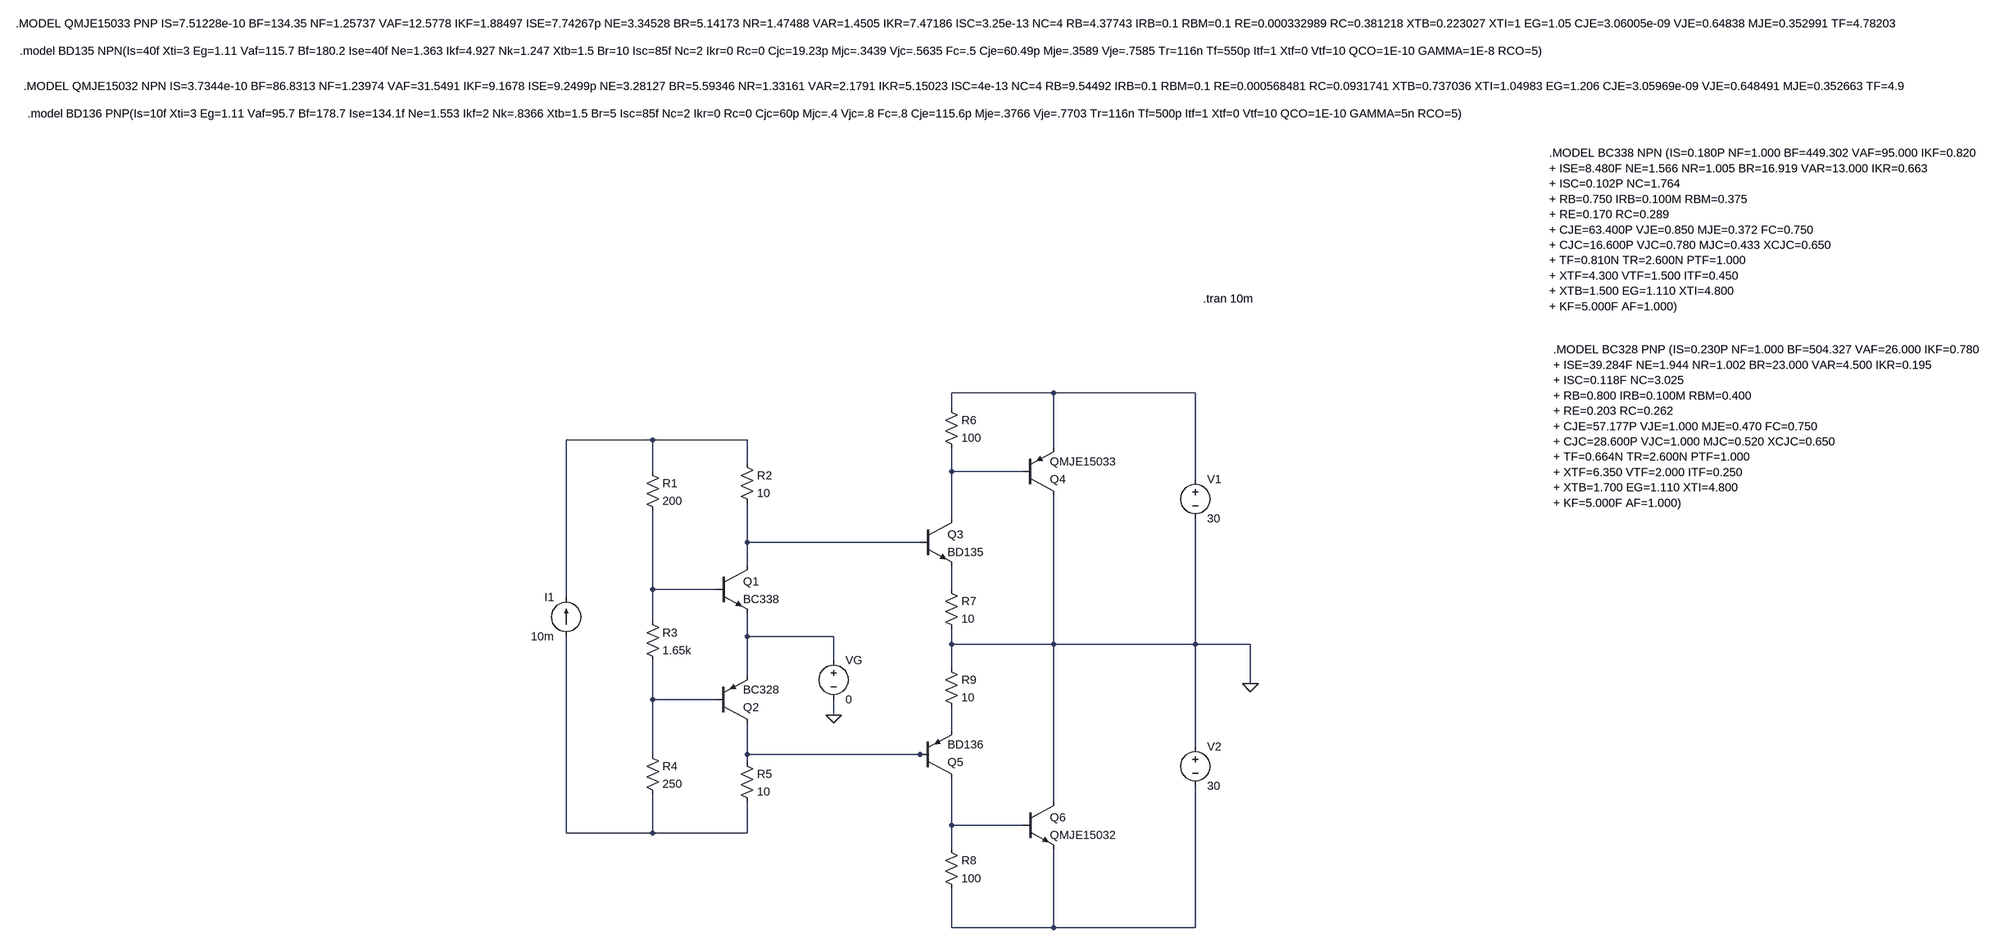
[diagram p0: schematic CircuitoCompleto.asc]
CircuitoCompleto.asc, the LTspice schematic file:
Version 4
SHEET 1 4400 680
WIRE 816 -480 608 -480
WIRE 1104 -480 816 -480
WIRE 608 -448 608 -480
WIRE 0 -384 -176 -384
WIRE 192 -384 0 -384
WIRE 816 -368 816 -480
WIRE 192 -336 192 -384
WIRE 0 -320 0 -384
WIRE 608 -320 608 -368
WIRE 752 -320 608 -320
WIRE 1104 -304 1104 -480
WIRE 608 -224 608 -320
WIRE 192 -176 192 -256
WIRE 544 -176 192 -176
WIRE 192 -128 192 -176
WIRE 0 -80 0 -240
WIRE 128 -80 0 -80
WIRE 608 -80 608 -128
WIRE -176 -64 -176 -384
WIRE 0 -16 0 -80
WIRE 192 16 192 -32
WIRE 368 16 192 16
WIRE 608 32 608 0
WIRE 816 32 816 -272
WIRE 816 32 608 32
WIRE 1104 32 1104 -224
WIRE 1104 32 816 32
WIRE 1216 32 1104 32
WIRE 368 64 368 16
WIRE 608 80 608 32
WIRE 192 96 192 16
WIRE 1216 112 1216 32
WIRE 0 144 0 64
WIRE 128 144 0 144
WIRE 368 176 368 144
WIRE 608 208 608 160
WIRE 1104 240 1104 32
WIRE 0 256 0 144
WIRE 192 256 192 192
WIRE 544 256 192 256
WIRE 560 256 544 256
WIRE 192 272 192 256
WIRE 816 352 816 32
WIRE 608 400 608 304
WIRE 752 400 608 400
WIRE -176 416 -176 16
WIRE 0 416 0 336
WIRE 0 416 -176 416
WIRE 192 416 192 352
WIRE 192 416 0 416
WIRE 608 448 608 400
WIRE 608 608 608 528
WIRE 816 608 816 448
WIRE 816 608 608 608
WIRE 1104 608 1104 320
WIRE 1104 608 816 608
FLAG 368 176 0
FLAG 1216 112 0
SYMBOL npn 128 -128 R0
SYMATTR InstName Q1
SYMATTR Value BC338
SYMBOL pnp 128 192 M180
SYMATTR InstName Q2
SYMATTR Value BC328
SYMBOL res -16 -336 R0
SYMATTR InstName R1
SYMATTR Value 200
SYMBOL res 176 -352 R0
SYMATTR InstName R2
SYMATTR Value 10
SYMBOL res -16 -32 R0
SYMATTR InstName R3
SYMATTR Value 1.65k
SYMBOL res -16 240 R0
SYMATTR InstName R4
SYMATTR Value 250
SYMBOL res 176 256 R0
SYMATTR InstName R5
SYMATTR Value 10
SYMBOL current -176 16 R180
WINDOW 0 24 80 Left 2
WINDOW 3 24 0 Left 2
SYMATTR InstName I1
SYMATTR Value 10m
SYMBOL npn 544 -224 R0
SYMATTR InstName Q3
SYMATTR Value BD135
SYMBOL pnp 752 -272 M180
SYMATTR InstName Q4
SYMATTR Value QMJE15033
SYMBOL voltage 1104 -320 R0
SYMATTR InstName V1
SYMATTR Value 30
SYMBOL res 592 -464 R0
SYMATTR InstName R6
SYMATTR Value 100
SYMBOL res 592 -96 R0
SYMATTR InstName R7
SYMATTR Value 10
SYMBOL pnp 544 304 M180
SYMATTR InstName Q5
SYMATTR Value BD136
SYMBOL npn 752 352 R0
SYMATTR InstName Q6
SYMATTR Value QMJE15032
SYMBOL res 592 432 R0
SYMATTR InstName R8
SYMATTR Value 100
SYMBOL res 592 64 R0
SYMATTR InstName R9
SYMATTR Value 10
SYMBOL voltage 1104 224 R0
SYMATTR InstName V2
SYMATTR Value 30
SYMBOL voltage 368 48 R0
SYMATTR InstName VG
SYMATTR Value 0
TEXT 1120 -672 Left 2 !.tran 10m
TEXT -1288 -1176 Left 2 !.model BD135 NPN(Is=40f Xti=3 Eg=1.11 Vaf=115.7 Bf=180.2 Ise=40f Ne=1.363 Ikf=4.927 Nk=1.247 Xtb=1.5 Br=10 Isc=85f Nc=2 Ikr=0 Rc=0 Cjc=19.23p Mjc=.3439 Vjc=.5635 Fc=.5 Cje=60.49p Mje=.3589 Vje=.7585 Tr=116n Tf=550p Itf=1 Xtf=0 Vtf=10 QCO=1E-10 GAMMA=1E-8 RCO=5)
TEXT -1296 -1232 Left 2 !.MODEL QMJE15033 PNP IS=7.51228e-10 BF=134.35 NF=1.25737 VAF=12.5778 IKF=1.88497 ISE=7.74267p NE=3.34528 BR=5.14173 NR=1.47488 VAR=1.4505 IKR=7.47186 ISC=3.25e-13 NC=4 RB=4.37743 IRB=0.1 RBM=0.1 RE=0.000332989 RC=0.381218 XTB=0.223027 XTI=1 EG=1.05 CJE=3.06005e-09 VJE=0.64838 MJE=0.352991 TF=4.78203e-09 XTF=1.50001 VTF=1.00006 ITF=0.999988 CJC=3.00101e-10 VJC=0.600019 MJC=0.409916 XCJC=0.8 FC=0.534975 TR=1e-07
TEXT -1272 -1048 Left 2 !.model BD136 PNP(Is=10f Xti=3 Eg=1.11 Vaf=95.7 Bf=178.7 Ise=134.1f Ne=1.553 Ikf=2 Nk=.8366 Xtb=1.5 Br=5 Isc=85f Nc=2 Ikr=0 Rc=0 Cjc=60p Mjc=.4 Vjc=.8 Fc=.8 Cje=115.6p Mje=.3766 Vje=.7703 Tr=116n Tf=500p Itf=1 Xtf=0 Vtf=10 QCO=1E-10 GAMMA=5n RCO=5)
TEXT -1280 -1104 Left 2 !.MODEL QMJE15032 NPN IS=3.7344e-10 BF=86.8313 NF=1.23974 VAF=31.5491 IKF=9.1678 ISE=9.2499p NE=3.28127 BR=5.59346 NR=1.33161 VAR=2.1791 IKR=5.15023 ISC=4e-13 NC=4 RB=9.54492 IRB=0.1 RBM=0.1 RE=0.000568481 RC=0.0931741 XTB=0.737036 XTI=1.04983 EG=1.206 CJE=3.05969e-09 VJE=0.648491 MJE=0.352663 TF=4.94819e-09 XTF=1.50001 VTF=1.0001 ITF=0.999982 CJC=3.00108e-10 VJC=0.600021 MJC=0.40991 XCJC=0.8 FC=0.534651 TR=1e-07
TEXT 1824 -968 Left 2 !.MODEL BC338 NPN (IS=0.180P NF=1.000 BF=449.302 VAF=95.000 IKF=0.820 \n+ ISE=8.480F NE=1.566 NR=1.005 BR=16.919 VAR=13.000 IKR=0.663 \n+ ISC=0.102P NC=1.764 \n+ RB=0.750 IRB=0.100M RBM=0.375 \n+ RE=0.170 RC=0.289 \n+ CJE=63.400P VJE=0.850 MJE=0.372 FC=0.750 \n+ CJC=16.600P VJC=0.780 MJC=0.433 XCJC=0.650 \n+ TF=0.810N TR=2.600N PTF=1.000 \n+ XTF=4.300 VTF=1.500 ITF=0.450 \n+ XTB=1.500 EG=1.110 XTI=4.800 \n+ KF=5.000F AF=1.000)
TEXT 1832 -568 Left 2 !.MODEL BC328 PNP (IS=0.230P NF=1.000 BF=504.327 VAF=26.000 IKF=0.780 \n+ ISE=39.284F NE=1.944 NR=1.002 BR=23.000 VAR=4.500 IKR=0.195 \n+ ISC=0.118F NC=3.025 \n+ RB=0.800 IRB=0.100M RBM=0.400 \n+ RE=0.203 RC=0.262 \n+ CJE=57.177P VJE=1.000 MJE=0.470 FC=0.750 \n+ CJC=28.600P VJC=1.000 MJC=0.520 XCJC=0.650 \n+ TF=0.664N TR=2.600N PTF=1.000 \n+ XTF=6.350 VTF=2.000 ITF=0.250 \n+ XTB=1.700 EG=1.110 XTI=4.800 \n+ KF=5.000F AF=1.000)

The netlist it stands for:
* CircuitoCompleto.asc
Q1 N004 N005 N007 0 BC338
Q2 N010 N008 N007 0 BC328
R1 N002 N005 200
R2 N002 N004 10
R3 N005 N008 1.65k
R4 N008 N012 250
R5 N010 N012 10
I1 N012 N002 10m
Q3 N003 N004 N006 0 BD135
Q4 0 N003 N001 0 QMJE15033
V1 N001 0 30
R6 N001 N003 100
R7 N006 0 10
Q5 N011 N010 N009 0 BD136
Q6 0 N011 N013 0 QMJE15032
R8 N011 N013 100
R9 0 N009 10
V2 0 N013 30
VG N007 0 0
.model NPN NPN
.model PNP PNP
.lib standard.bjt
.tran 10m
.model BD135 NPN(Is=40f Xti=3 Eg=1.11 Vaf=115.7 Bf=180.2 Ise=40f Ne=1.363 Ikf=4.927 Nk=1.247 Xtb=1.5 Br=10 Isc=85f Nc=2 Ikr=0 Rc=0 Cjc=19.23p Mjc=.3439 Vjc=.5635 Fc=.5 Cje=60.49p Mje=.3589 Vje=.7585 Tr=116n Tf=550p Itf=1 Xtf=0 Vtf=10 QCO=1E-10 GAMMA=1E-8 RCO=5)
.MODEL QMJE15033 PNP IS=7.51228e-10 BF=134.35 NF=1.25737 VAF=12.5778 IKF=1.88497 ISE=7.74267p NE=3.34528 BR=5.14173 NR=1.47488 VAR=1.4505 IKR=7.47186 ISC=3.25e-13 NC=4 RB=4.37743 IRB=0.1 RBM=0.1 RE=0.000332989 RC=0.381218 XTB=0.223027 XTI=1 EG=1.05 CJE=3.06005e-09 VJE=0.64838 MJE=0.352991 TF=4.78203e-09 XTF=1.50001 VTF=1.00006 ITF=0.999988 CJC=3.00101e-10 VJC=0.600019 MJC=0.409916 XCJC=0.8 FC=0.534975 TR=1e-07
.model BD136 PNP(Is=10f Xti=3 Eg=1.11 Vaf=95.7 Bf=178.7 Ise=134.1f Ne=1.553 Ikf=2 Nk=.8366 Xtb=1.5 Br=5 Isc=85f Nc=2 Ikr=0 Rc=0 Cjc=60p Mjc=.4 Vjc=.8 Fc=.8 Cje=115.6p Mje=.3766 Vje=.7703 Tr=116n Tf=500p Itf=1 Xtf=0 Vtf=10 QCO=1E-10 GAMMA=5n RCO=5)
.MODEL QMJE15032 NPN IS=3.7344e-10 BF=86.8313 NF=1.23974 VAF=31.5491 IKF=9.1678 ISE=9.2499p NE=3.28127 BR=5.59346 NR=1.33161 VAR=2.1791 IKR=5.15023 ISC=4e-13 NC=4 RB=9.54492 IRB=0.1 RBM=0.1 RE=0.000568481 RC=0.0931741 XTB=0.737036 XTI=1.04983 EG=1.206 CJE=3.05969e-09 VJE=0.648491 MJE=0.352663 TF=4.94819e-09 XTF=1.50001 VTF=1.0001 ITF=0.999982 CJC=3.00108e-10 VJC=0.600021 MJC=0.40991 XCJC=0.8 FC=0.534651 TR=1e-07
.MODEL BC338 NPN (IS=0.180P NF=1.000 BF=449.302 VAF=95.000 IKF=0.820
+ ISE=8.480F NE=1.566 NR=1.005 BR=16.919 VAR=13.000 IKR=0.663
+ ISC=0.102P NC=1.764
+ RB=0.750 IRB=0.100M RBM=0.375
+ RE=0.170 RC=0.289
+ CJE=63.400P VJE=0.850 MJE=0.372 FC=0.750
+ CJC=16.600P VJC=0.780 MJC=0.433 XCJC=0.650
+ TF=0.810N TR=2.600N PTF=1.000
+ XTF=4.300 VTF=1.500 ITF=0.450
+ XTB=1.500 EG=1.110 XTI=4.800
+ KF=5.000F AF=1.000)
.MODEL BC328 PNP (IS=0.230P NF=1.000 BF=504.327 VAF=26.000 IKF=0.780
+ ISE=39.284F NE=1.944 NR=1.002 BR=23.000 VAR=4.500 IKR=0.195
+ ISC=0.118F NC=3.025
+ RB=0.800 IRB=0.100M RBM=0.400
+ RE=0.203 RC=0.262
+ CJE=57.177P VJE=1.000 MJE=0.470 FC=0.750
+ CJC=28.600P VJC=1.000 MJC=0.520 XCJC=0.650
+ TF=0.664N TR=2.600N PTF=1.000
+ XTF=6.350 VTF=2.000 ITF=0.250
+ XTB=1.700 EG=1.110 XTI=4.800
+ KF=5.000F AF=1.000)
.backanno
.end